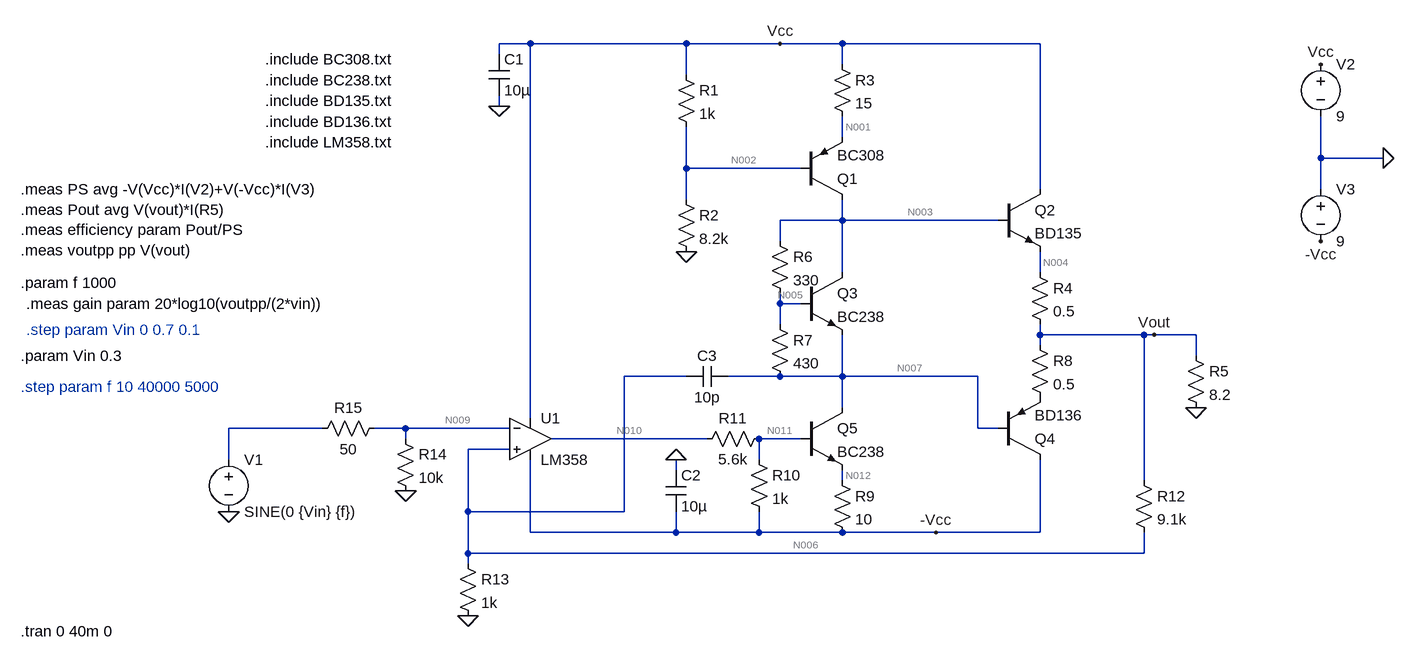
[diagram p0: schematic Lab3.asc]
Lab3.asc, the LTspice schematic file:
Version 4
SHEET 1 2020 920
WIRE 688 0 640 0
WIRE 928 0 688 0
WIRE 1072 0 928 0
WIRE 1168 0 1072 0
WIRE 1472 0 1168 0
WIRE 640 16 640 0
WIRE 1168 32 1168 0
WIRE 928 48 928 0
WIRE 640 96 640 80
WIRE 1168 144 1168 112
WIRE 1904 176 1904 112
WIRE 2000 176 1904 176
WIRE 928 192 928 128
WIRE 1104 192 928 192
WIRE 1472 224 1472 0
WIRE 1904 224 1904 176
WIRE 928 240 928 192
WIRE 1168 272 1168 240
WIRE 1168 272 1072 272
WIRE 1408 272 1168 272
WIRE 1072 304 1072 272
WIRE 1168 352 1168 272
WIRE 1472 352 1472 320
WIRE 1072 400 1072 384
WIRE 1104 400 1072 400
WIRE 1072 432 1072 400
WIRE 1472 448 1472 432
WIRE 1632 448 1472 448
WIRE 1648 448 1632 448
WIRE 1712 448 1648 448
WIRE 1472 464 1472 448
WIRE 1712 480 1712 448
WIRE 928 512 832 512
WIRE 1072 512 992 512
WIRE 1168 512 1168 448
WIRE 1168 512 1072 512
WIRE 1376 512 1168 512
WIRE 1168 560 1168 512
WIRE 688 576 688 0
WIRE 368 592 224 592
WIRE 496 592 448 592
WIRE 656 592 496 592
WIRE 1376 592 1376 512
WIRE 1408 592 1376 592
WIRE 496 608 496 592
WIRE 960 608 720 608
WIRE 1104 608 1040 608
WIRE 656 624 592 624
WIRE 224 640 224 592
WIRE 1040 640 1040 608
WIRE 912 656 912 640
WIRE 1168 672 1168 656
WIRE 1632 672 1632 448
WIRE 592 720 592 624
WIRE 832 720 832 512
WIRE 832 720 592 720
WIRE 688 752 688 640
WIRE 912 752 912 720
WIRE 912 752 688 752
WIRE 1040 752 1040 720
WIRE 1040 752 912 752
WIRE 1168 752 1040 752
WIRE 1312 752 1168 752
WIRE 1472 752 1472 640
WIRE 1472 752 1312 752
WIRE 592 784 592 720
WIRE 1632 784 1632 752
WIRE 1632 784 592 784
WIRE 592 800 592 784
FLAG 640 96 0
FLAG 928 320 0
FLAG 1712 560 0
FLAG 1648 448 Vout
FLAG 912 640 0
FLAG 592 880 0
FLAG 496 688 0
FLAG 224 720 0
FLAG 1072 0 Vcc
FLAG 1312 752 -Vcc
FLAG 2000 176 0
FLAG 1904 32 Vcc
FLAG 1904 304 -Vcc
SYMBOL cap 624 16 R0
SYMATTR InstName C1
SYMATTR Value 10µ
SYMBOL res 912 32 R0
SYMATTR InstName R1
SYMATTR Value 1k
SYMBOL res 912 224 R0
SYMATTR InstName R2
SYMATTR Value 8.2k
SYMBOL pnp 1104 240 M180
SYMATTR InstName Q1
SYMATTR Value BC308
SYMBOL res 1152 16 R0
SYMATTR InstName R3
SYMATTR Value 15
SYMBOL npn 1408 224 R0
SYMATTR InstName Q2
SYMATTR Value BD135
SYMBOL res 1456 336 R0
SYMATTR InstName R4
SYMATTR Value 0.5
SYMBOL res 1696 464 R0
SYMATTR InstName R5
SYMATTR Value 8.2
SYMBOL res 1056 288 R0
SYMATTR InstName R6
SYMATTR Value 330
SYMBOL res 1056 416 R0
SYMATTR InstName R7
SYMATTR Value 430
SYMBOL npn 1104 352 R0
SYMATTR InstName Q3
SYMATTR Value BC238
SYMBOL res 1456 448 R0
SYMATTR InstName R8
SYMATTR Value 0.5
SYMBOL pnp 1408 640 M180
SYMATTR InstName Q4
SYMATTR Value BD136
SYMBOL npn 1104 560 R0
SYMATTR InstName Q5
SYMATTR Value BC238
SYMBOL res 1152 656 R0
SYMATTR InstName R9
SYMATTR Value 10
SYMBOL res 1024 624 R0
SYMATTR InstName R10
SYMATTR Value 1k
SYMBOL cap 896 656 R0
SYMATTR InstName C2
SYMATTR Value 10µ
SYMBOL res 1056 592 R90
WINDOW 0 0 56 VBottom 2
WINDOW 3 32 56 VTop 2
SYMATTR InstName R11
SYMATTR Value 5.6k
SYMBOL res 1616 656 R0
SYMATTR InstName R12
SYMATTR Value 9.1k
SYMBOL OpAmps\\opamp2 688 544 R0
SYMATTR InstName U1
SYMATTR Value LM358
SYMBOL cap 992 496 R90
WINDOW 0 0 32 VBottom 2
WINDOW 3 32 32 VTop 2
SYMATTR InstName C3
SYMATTR Value 10p
SYMBOL res 576 784 R0
SYMATTR InstName R13
SYMATTR Value 1k
SYMBOL res 480 592 R0
SYMATTR InstName R14
SYMATTR Value 10k
SYMBOL res 464 576 R90
WINDOW 0 0 56 VBottom 2
WINDOW 3 32 56 VTop 2
SYMATTR InstName R15
SYMATTR Value 50
SYMBOL voltage 224 624 R0
WINDOW 123 0 0 Left 0
WINDOW 39 0 0 Left 0
SYMATTR InstName V1
SYMATTR Value SINE(0 {Vin} {f})
SYMBOL voltage 1904 16 R0
WINDOW 123 0 0 Left 0
WINDOW 39 0 0 Left 0
SYMATTR InstName V2
SYMATTR Value 9
SYMBOL voltage 1904 208 R0
WINDOW 123 0 0 Left 0
WINDOW 39 0 0 Left 0
SYMATTR InstName V3
SYMATTR Value 9
TEXT 280 152 Left 2 !.include LM358.txt
TEXT 280 120 Left 2 !.include BD136.txt
TEXT 280 88 Left 2 !.include BD135.txt
TEXT 280 56 Left 2 !.include BC238.txt
TEXT 280 24 Left 2 !.include BC308.txt
TEXT -96 224 Left 2 !.meas PS avg -V(Vcc)*I(V2)+V(-Vcc)*I(V3)\n.meas Pout avg V(vout)*I(R5)\n.meas efficiency param Pout/PS \n.meas voutpp pp V(vout)
TEXT -96 368 Left 2 !.param f 1000
TEXT -96 904 Left 2 !.tran 0 40m 0
TEXT -88 400 Left 2 !.meas gain param 20*log10(voutpp/(2*vin))
TEXT -88 440 Left 2 ;.step param Vin 0 0.7 0.1
TEXT -96 480 Left 2 !.param Vin 0.3
TEXT -96 528 Left 2 ;.step param f 10 40000 5000

The netlist it stands for:
* Lab3.asc
C1 Vcc 0 10µ
R1 Vcc N002 1k
R2 N002 0 8.2k
Q1 N003 N002 N001 0 BC308
R3 Vcc N001 15
Q2 Vcc N003 N004 0 BD135
R4 N004 Vout 0.5
R5 Vout 0 8.2
R6 N003 N005 330
R7 N005 N007 430
Q3 N003 N005 N007 0 BC238
R8 Vout P001 0.5
Q4 -Vcc N007 P001 0 BD136
Q5 N007 N011 N012 0 BC238
R9 N012 -Vcc 10
R10 N011 -Vcc 1k
C2 0 -Vcc 10µ
R11 N011 N010 5.6k
R12 Vout N006 9.1k
XU1 N006 N009 Vcc -Vcc N010 LM358  ; pins In+ In- V+ V- OUT
C3 N007 N006 10p
R13 N006 0 1k
R14 N009 0 10k
R15 N009 N008 50
V1 N008 0 SINE(0 {Vin} {f})
V2 Vcc 0 9
V3 0 -Vcc 9
.model NPN NPN
.model PNP PNP
.lib standard.bjt
.include LM358.txt
.include BD136.txt
.include BD135.txt
.include BC238.txt
.include BC308.txt
.meas PS avg -V(Vcc)*I(V2)+V(-Vcc)*I(V3)
.meas Pout avg V(vout)*I(R5)
.meas efficiency param Pout/PS
.meas voutpp pp V(vout)
.param f 1000
.tran 0 40m 0
.meas gain param 20*log10(voutpp/(2*vin))
* .step param Vin 0 0.7 0.1
.param Vin 0.3
* .step param f 10 40000 5000
.backanno
.end

* Results of the author's LTspice run, read from the files saved beside the schematic
* Operating Point, zero values left out:
*   V(vcc) = 9 V
*   V(n002) = 8.058 V
*   V(n003) = 649 mV
*   V(n001) = 8.761 V
*   V(n004) = 1.916 mV
*   V(vout) = -377.8 µV
*   V(n005) = 82.27 mV
*   V(n007) = -635.4 mV
*   V(p001) = -2.695 mV
*   V(-vcc) = -9 V
*   V(n011) = -8.121 V
*   V(n012) = -8.841 V
*   V(n010) = -2.923 V
*   V(n006) = -28.4 µV
*   V(n009) = 497.3 nV
*   Ic(Q1) = -15.88 mA
*   Ib(Q1) = -40.34 µA
*   Ie(Q1) = 15.92 mA
*   Ic(Q2) = 4.553 mA
*   Ib(Q2) = 35.78 µA
*   Ie(Q2) = -4.589 mA
*   Ic(Q3) = 14.12 mA
*   Ib(Q3) = 48.25 µA
*   Ie(Q3) = -14.17 mA
*   Ic(Q5) = 15.86 mA
*   Ib(Q5) = 49.72 µA
*   Ie(Q5) = -15.91 mA
*   Ic(Q4) = -4.62 mA
*   Ib(Q4) = -15.12 µA
*   Ie(Q4) = 4.635 mA
*   I(R1) = 942.3 µA
*   I(R2) = 982.6 µA
*   I(R3) = 15.92 mA
*   I(R4) = 4.589 mA
*   I(R5) = -46.08 µA
*   I(R6) = 1.717 mA
*   I(R7) = 1.669 mA
*   I(R8) = 4.635 mA
*   I(R9) = 15.91 mA
*   I(R10) = 878.6 µA
*   I(R11) = -928.3 µA
*   I(R12) = -38.4 nA
*   I(R13) = -28.4 nA
*   I(R14) = 49.73 pA
*   I(R15) = 9.946 nA
*   I(V1) = 9.946 nA
*   I(V2) = -21.76 mA
*   I(V3) = -20.82 mA
*   Ix(u1:2) = -10 nA
*   Ix(u1:1) = -9.996 nA
*   Ix(u1:4) = 343.3 µA
*   Ix(u1:5) = 585.1 µA
*   Ix(u1:3) = -928.3 µA
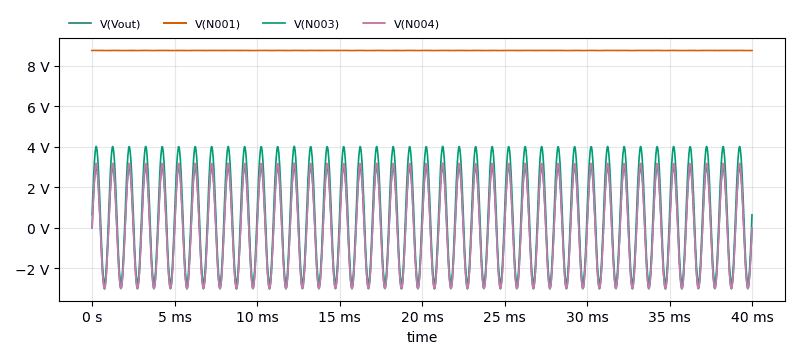
[diagram p1: Transient Analysis of Lab3.asc, plotted from the saved traces]
* Transient Analysis, 1 run:
*   V(Vout): min -3.014 V, max 3.014 V, average -2.956 mV, rms 2.114 V, last -4.495 mV
*   V(N001): min 8.755 V, max 8.768 V, average 8.761 V, rms 8.761 V, last 8.761 V
*   V(N003): min -2.762 V, max 4.025 V, average 633.8 mV, rms 2.477 V, last 643.2 mV
*   V(N004): min -3.014 V, max 3.198 V, average 55.05 mV, rms 2.179 V, last -2.324 mV
* From the log:
*   ps: AVG(-v(vcc)*i(v2)+v(-vcc)*i(v3))=2.37275 FROM 0 TO 0.04
*   pout: AVG(v(vout)*i(r5))=0.542 FROM 0 TO 0.04
*   efficiency: pout/ps=0.228427
*   voutpp: PP(v(vout))=6.03044 FROM 0 TO 0.04
*   gain: 20*log10(voutpp/(2*vin))=20.0439